# EAGLE schematic midi (EAGLE 7.2.0)
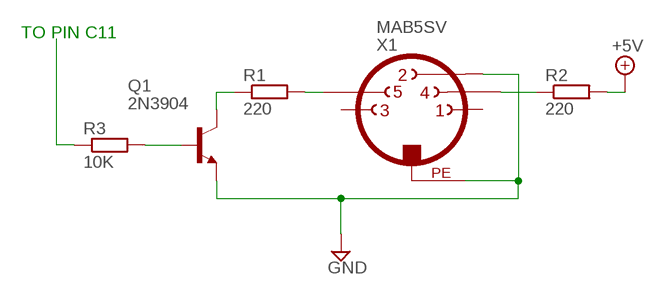
[diagram p0: schematic, sheet 1]

## Parts
Q1  2N3904  [TO92]
R1  220  R-EU_0309/12  [0309/12]
R2  220  R-EU_0309/12  [0309/12]
R3  10K  R-EU_0309/12  [0309/12]
X1  MAB5SV  [MAB5SV]

## Nets
+5V: R2.2
GND: Q1.3(E) X1.2 X1.PE
N$1: Q1.2(B) R3.2
N$2: Q1.1(C) R1.1
N$3: R1.2 X1.5
N$4: R2.1 X1.4
N$5: R3.1
Unconnected: X1.1 X1.3

## Notes on the sheet
- TO PIN C11

## Library data of the parts
Q1 = transistor-npn:2N3904: NPN Transistor
R1-R3 = resistor:R-EU_: RESISTOR, European symbol
X1 = con-hirschmann:MAB5SV: Female CONNECTOR 5 pins 90 deg. with shield, vertical (DIN41524); OC_FARNELL: unknown; OC_NEWARK: unknown